# EAGLE schematic Adafruit_TMP117 (EAGLE 9.6.2)
COMPANY: ADAFRUIT INDUSTRIES; DRAWN: KTOWN; REV: A
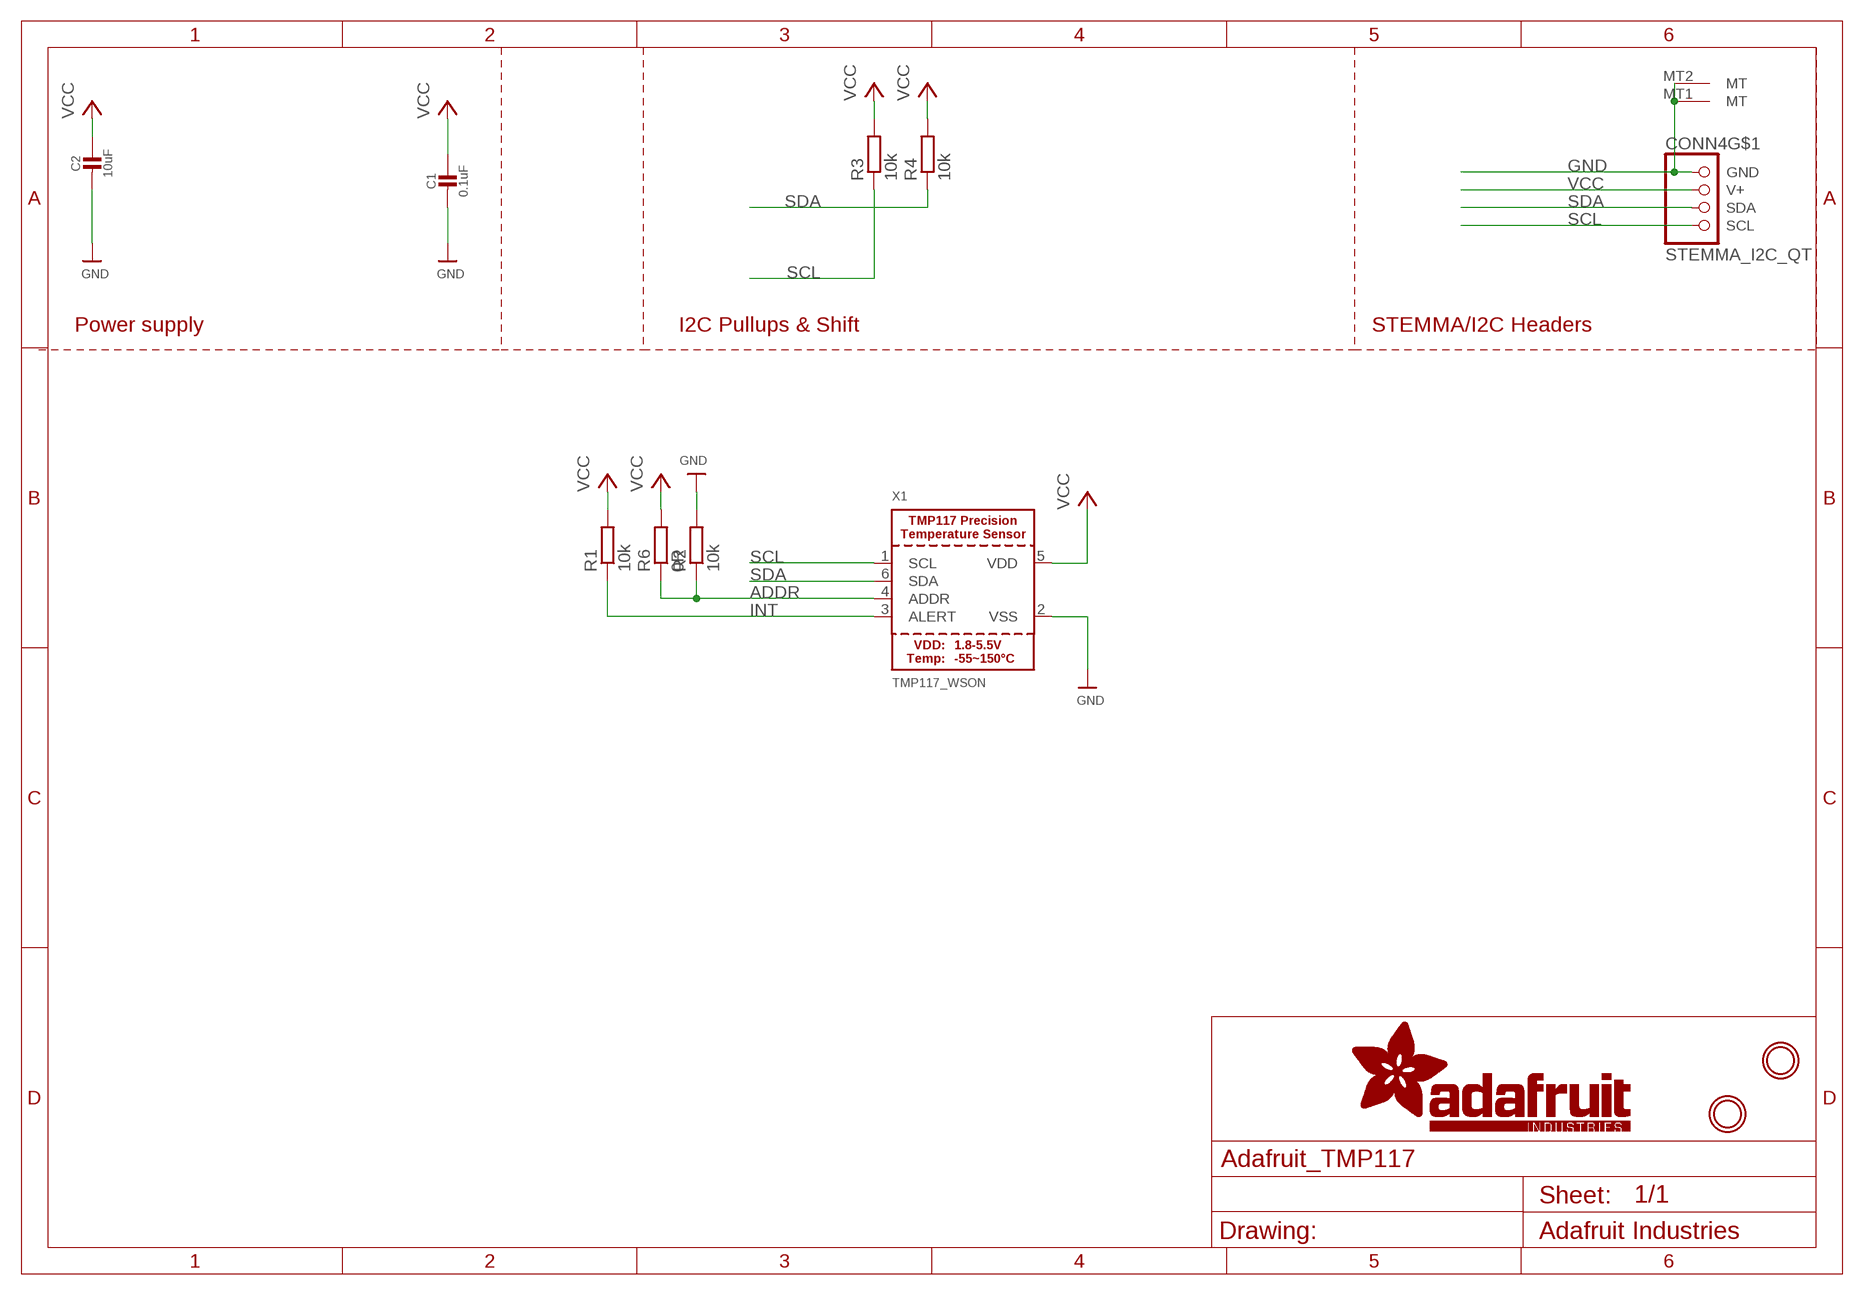
[diagram p0: schematic, sheet 1]

## Parts
C1  0.1uF  CAP_CERAMIC_0402  [_0402]
C2  10uF  CAP_CERAMIC_0603  [_0603]
CONN4  STEMMA_I2C_QT  [JST_SH4]
R1  10k  R-EU_R0402  [R0402]
R2  10k  R-EU_R0402  [R0402]
R3  10k  R-EU_R0402  [R0402]
R4  10k  R-EU_R0402  [R0402]
R6  0R  R-EU_R0402  [R0402]
U$1  MOUNTINGHOLE2.5  [MOUNTINGHOLE_2.5_PLATED]
U$19  MOUNTINGHOLE2.5  [MOUNTINGHOLE_2.5_PLATED]
X1  TMP117_WSON  [WSON-6]

## Nets
ADDR: R2.1 R6.1 X1.4(ADDR)
GND [highpower]: C1.2 C2.2 CONN4.1(GND) CONN4.MT1(MT) CONN4.MT2(MT) R2.2 X1.2(VSS)
INT: R1.1 X1.3(ALERT)
SCL: CONN4.4(SCL) R3.1 X1.1(SCL)
SDA: CONN4.3(SDA) R4.1 X1.6(SDA)
VCC [highpower]: C1.1 C2.1 CONN4.2(V+) R1.2 R3.2 R4.2 R6.2 X1.5(VDD)

## Notes on the sheet
- Power supply | I2C Pullups & Shift | STEMMA/I2C Headers

## Library data of the parts
C1 C2 = microbuilder:CAP_CERAMIC: Ceramic Capacitors For new designs, use the packages preceded by an '_' character since they are more reliable: The following footprints should be used on most boards: _0402 - Standard footprint for regular board layouts _0603 - Standard footprint for regular board layouts _0805 - Standard footprint for regular board layouts _1206 - Standard footprint for regular board layouts For extremely tight-pitch boards where space is at a premium, the following 'micro-pitch' footprints can be used (smaller pads, no silkscreen outline, etc.): _0402MP - Micro-pitch footprint for very dense/compact boards _0603MP - Micro-pitch footprint for very dense/compact boards _0805MP - Micro-pitch footprint for very dense/compact boards _1206MP - Micro-pitch footprint for very dense/compact boards
CONN4 = microbuilder:STEMMA_I2C
R1-R4 R6 = rcl:R-EU_: RESISTOR, European symbol; SPICEPREFIX: R
U$1 U$19 = microbuilder:MOUNTINGHOLE: Mounting Hole For #2 screws (0.086"/2.18mm width, 0.094"/2.4mm hole) use 2.5mm; BOM: EXCLUDE
X1 = adafruit_sensor:TMP117

## Net classes
1 highpower: width 0.305 mm, drill 0.483 mm
2 lowpower: width 0.254 mm, drill 0.483 mm